# EAGLE design 2313 (EAGLE 7.5.0)
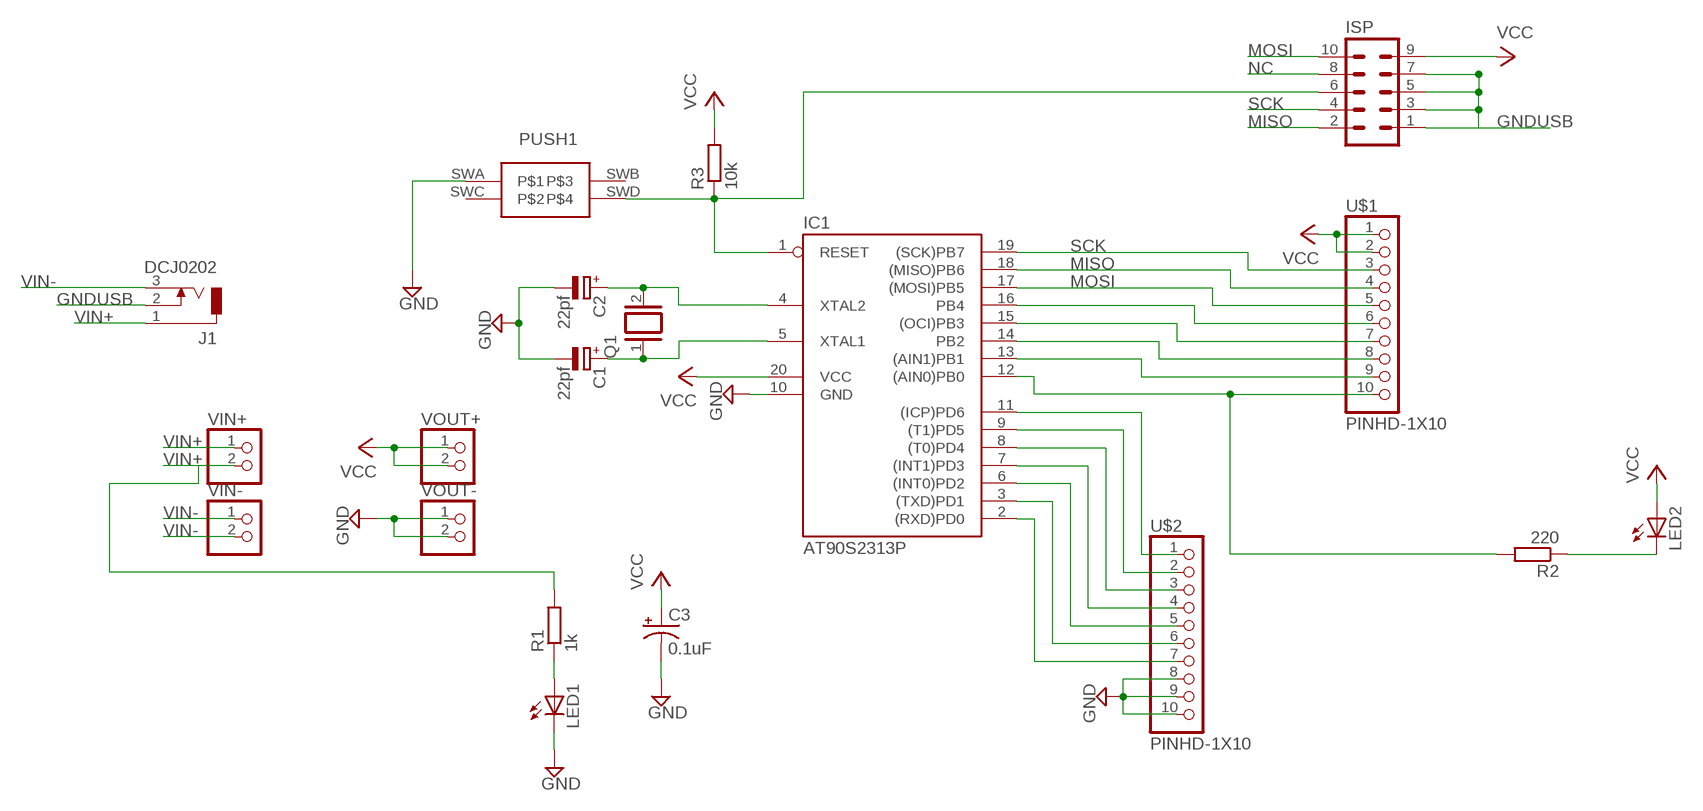
[diagram p0: schematic, sheet 1]

## Parts
C1  22pf  CPOL-EUE1.8-4  [E1,8-4]
C2  22pf  CPOL-EUE1.8-4  [E1,8-4]
C3  0.1uF  CPOL-USE1.8-4  [E1,8-4]
IC1  AT90S2313P  [DIL20]
ISP  MA05-2  [MA05-2]
J1  DCJ0202  [DCJ0202]
LED1  LED3MM  [LED3MM]
LED2  LED3MM  [LED3MM]
PUSH1  PUSH_BUTTON  [PUSH_BUTTON]
Q1  XTAL  [Q]
R1  1k  R-EU_0204/7  [0204/7]
R2  220  R-EU_0204/7  [0204/7]
R3  10k  R-EU_0204/7  [0204/7]
U$1  PINHD-1X10  [1X10-BIG]
U$2  PINHD-1X10  [1X10-BIG]
VIN+  PINHD-1X2  [1X02]
VIN-  PINHD-1X2  [1X02]
VOUT+  PINHD-1X2  [1X02]
VOUT-  PINHD-1X2  [1X02]

## Nets
GND: C1.- C2.- C3.- IC1.10(GND) LED1.K(C) PUSH1.SWA U$2.8 U$2.9 U$2.10 VOUT-.1 VOUT-.2
GNDUSB: ISP.1 ISP.3 ISP.5 ISP.7 J1.2
MISO: IC1.18((MISO)PB6) ISP.2 U$1.4
MOSI: IC1.17((MOSI)PB5) ISP.10 U$1.5
N$1: C1.+ IC1.5(XTAL1) Q1.1
N$2: C2.+ IC1.4(XTAL2) Q1.2
N$3: IC1.1(RESET) ISP.6 PUSH1.SWD R3.1
N$4: IC1.11((ICP)PD6) U$2.1
N$5: IC1.13((AIN1)PB1) U$1.9
N$6: IC1.14(PB2) U$1.8
N$7: IC1.15((OCI)PB3) U$1.7
N$8: IC1.16(PB4) U$1.6
N$9: IC1.12((AIN0)PB0) R2.2 U$1.10
N$10: IC1.9((T1)PD5) U$2.2
N$11: IC1.8((T0)PD4) U$2.3
N$12: IC1.7((INT1)PD3) U$2.4
N$13: IC1.6((INT0)PD2) U$2.5
N$14: IC1.3((TXD)PD1) U$2.6
N$15: IC1.2((RXD)PD0) U$2.7
N$16: LED1.A R1.1
N$17: LED2.K(C) R2.1
NC: ISP.8
SCK: IC1.19((SCK)PB7) ISP.4 U$1.3
VCC: C3.+ IC1.20(VCC) ISP.9 LED2.A R3.2 U$1.1 U$1.2 VOUT+.1 VOUT+.2
VIN+: J1.1 R1.2 VIN+.1 VIN+.2
VIN-: J1.3 VIN-.1 VIN-.2
Unconnected: PUSH1.SWB PUSH1.SWC

## Library data of the parts
C1 C2 = resistor:CPOL-EU: POLARIZED CAPACITOR, European symbol
C3 = adafruit:CPOL-US: POLARIZED CAPACITOR, American symbol
IC1 = atmel:AT90S2313: MICROCONTROLLER 2 Kbytes FLASH 128 bytes SRAM 128 bytes EEPROM UART; OC_FARNELL: unknown; OC_NEWARK: unknown
ISP = con-lstb:MA05-2: PIN HEADER; OC_FARNELL: unknown; OC_NEWARK: unknown
J1 = con-jack:DCJ0202: DC POWER JACK Source: DCJ0202.pdf; OC_FARNELL: unknown; OC_NEWARK: unknown
LED1 LED2 = adafruit:LED: LED OSRAM: - CHIPLED LG R971, LG N971, LY N971, LG Q971, LY Q971, LO R971, LY R971 LH N974, LH R974 LS Q976, LO Q976, LY Q976 LO Q996 - Hyper CHIPLED LW Q18S LB Q993, LB Q99A, LB R99A - SideLED LS A670, LO A670, LY A670, LG A670, LP A670 LB A673, LV A673, LT A673, LW A673 LH A674 LY A675 LS A676, LA A676, LO A676, LY A676, LW A676 LS A679, LY A679, LG A679 - Hyper Micro SIDELED® LS Y876, LA Y876, LO Y876, LY Y876 LT Y87S - SmartLED LW L88C, LW L88S LB L89C, LB L89S, LG L890 LS L89K, LO L89K, LY L89K LS L896, LA L896, LO L896, LY L896 - TOPLED LS T670, LO T670, LY T670, LG T670, LP T670 LSG T670, LSP T670, LSY T670, LOP T670, LYG T670 LG T671, LOG T671, LSG T671 LB T673, LV T673, LT T673, LW T673 LH T674 LS T676, LA T676, LO T676, LY T676, LB T676, LH T676, LSB T676, LW T676 LB T67C, LV T67C, LT T67C, LS T67K, LO T67K, LY T67K, LW E67C LS E67B, LA E67B, LO E67B, LY E67B, LB E67C, LV E67C, LT E67C LW T67C LS T679, LY T679, LG T679 LS T770, LO T770, LY T770, LG T770, LP T770 LB T773, LV T773, LT T773, LW T773 LH T774 LS E675, LA E675, LY E675, LS T675 LS T776, LA T776, LO T776, LY T776, LB T776 LHGB T686 LT T68C, LB T68C - Hyper Mini TOPLED® LB M676 - Mini TOPLED Santana® LG M470 LS M47K, LO M47K, LY M47K Source: http://www.osram.convergy.de/
PUSH1 = Evhyn:PUSH_BUTTON
Q1 = special:XTAL: CRYSTAL
R1-R3 = rcl:R-EU_: RESISTOR, European symbol
U$1 U$2 = adafruit:PINHD-1X10: Pin header 1x10 0.1" spacing With round pins
VIN+ VIN- VOUT+ VOUT- = pinhead:PINHD-1X2: PIN HEADER

## Board
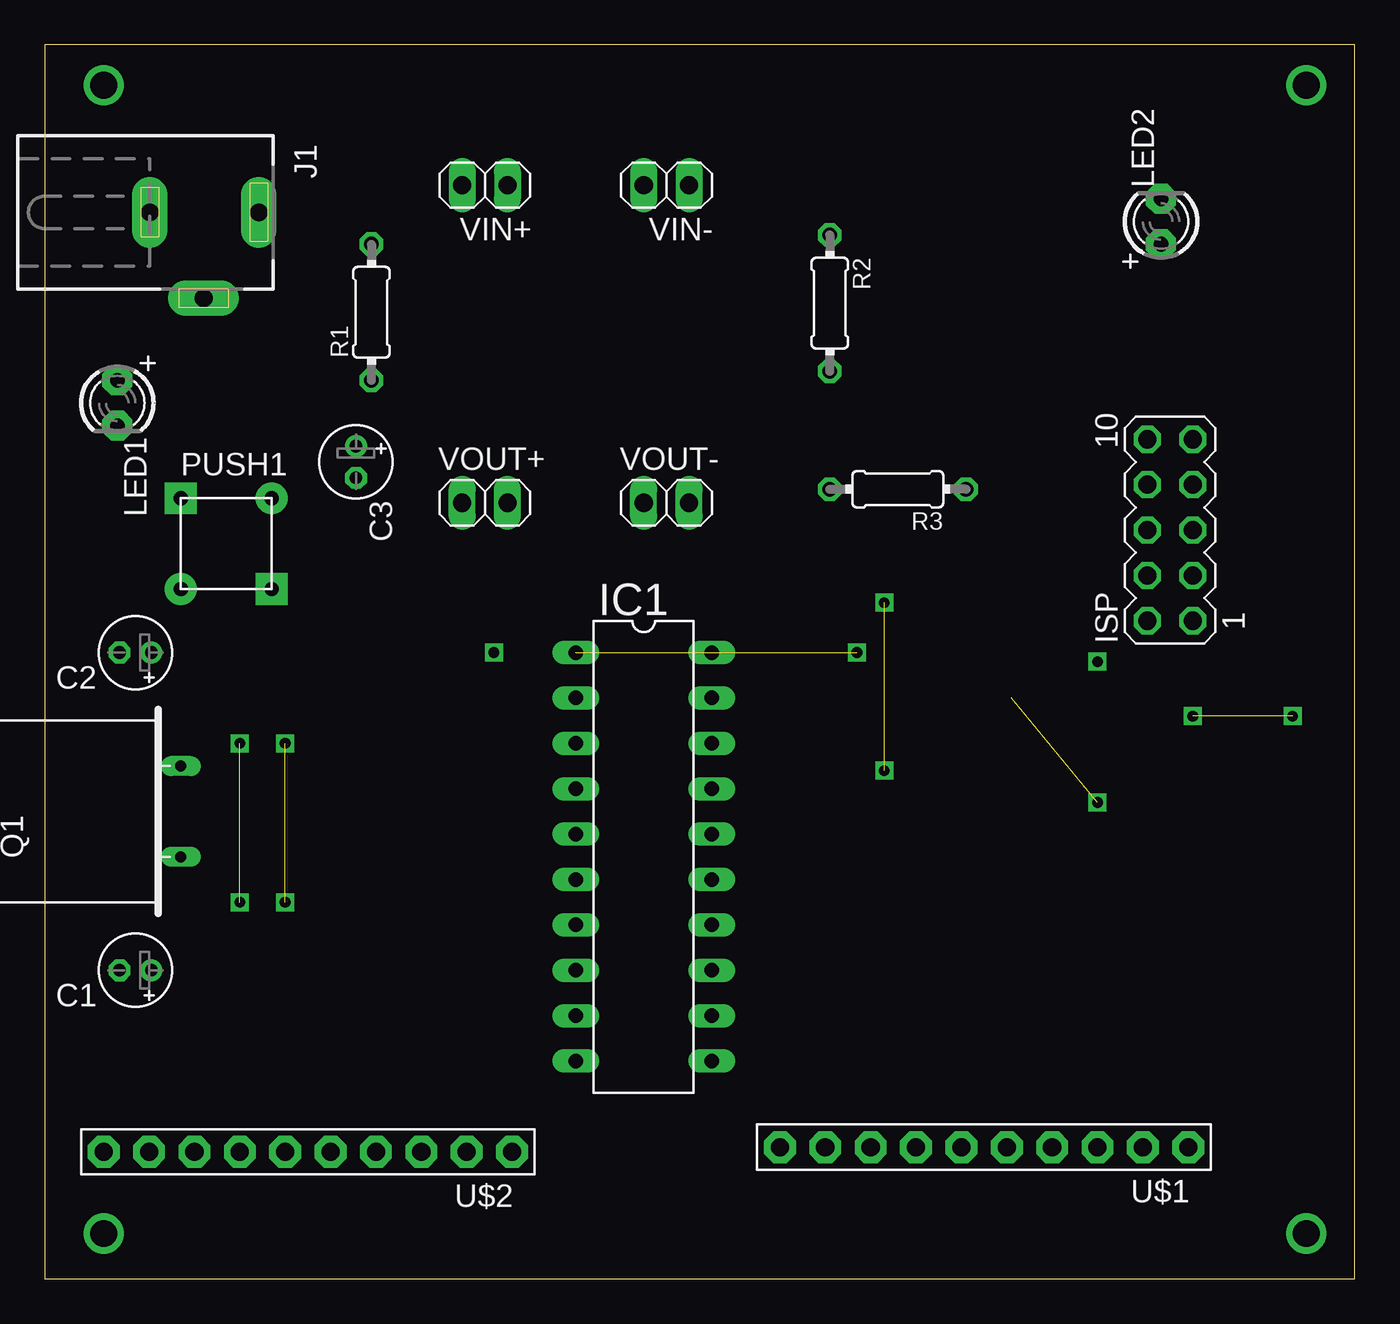
[diagram p1: board, top side]
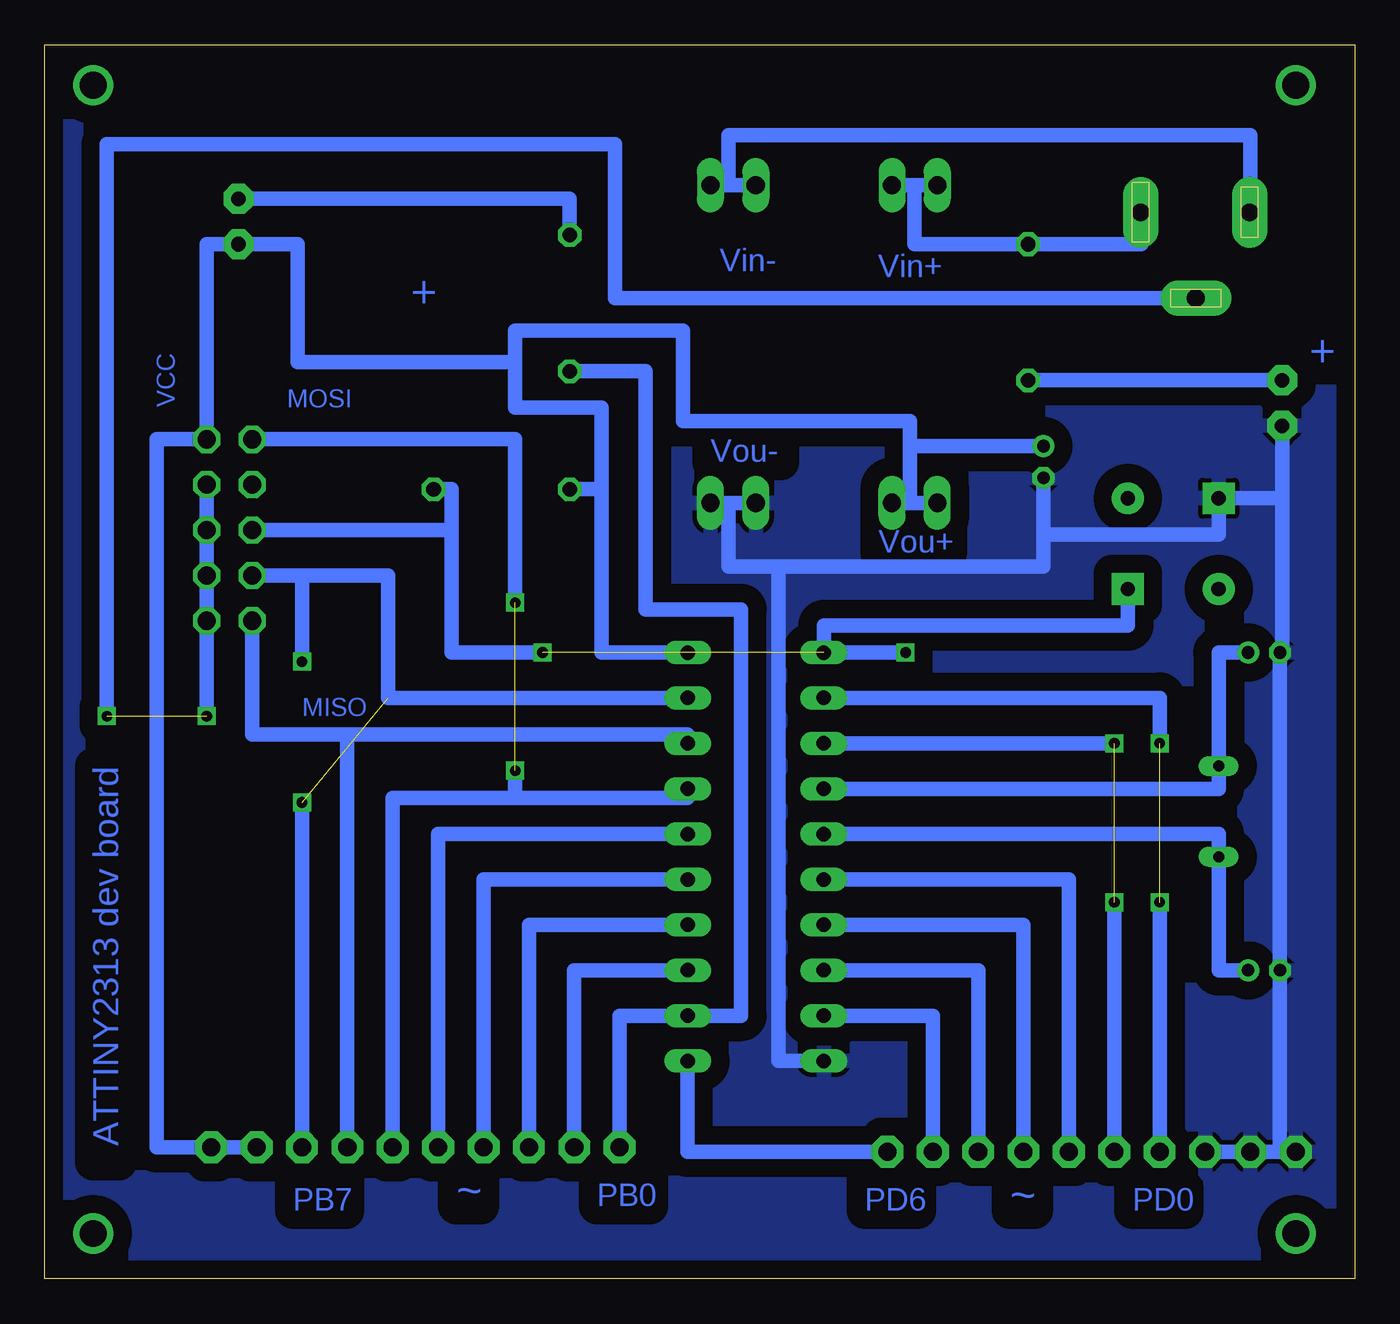
[diagram p2: board, bottom side, seen from below]

Size 73.33 x 69.08 mm. Coordinates in mm from the lower left corner, seen from the top.
Outline: 0,0 73.33,0 73.33,69.08 0,69.08 0,0
Copper layers (1*16): Top 0.035mm / dielectric 1.5mm / Bottom 0.035mm
Design rules "default *": minimum track width 24mil, minimum drill 24mil, track to track 40mil, track to pad 40mil, pad to pad 40mil, via to via 40mil, smd to smd 8mil, copper to edge 40mil, drill to drill 8mil, minimum pad ring 10mil, minimum via ring 8mil, stop-mask expansion 4mil, vias tented up to drill 0mil, thermal gap 10mil

### Footprints (pad centres in the part's own frame; a part is rotated, then mirrored left to right if it is on the bottom)
E1,8-4 = drill 0.711 pad 1.168: + -0.889,0 | drill 0.711 pad 1.168 octagon: - 0.889,0
DIL20 = drill 0.813 long: 1 -11.43,-3.81; 2 -8.89,-3.81; 3 -6.35,-3.81; 4 -3.81,-3.81; 5 -1.27,-3.81; 6 1.27,-3.81; 7 3.81,-3.81; 8 6.35,-3.81; 9 8.89,-3.81; 10 11.43,-3.81; 11 11.43,3.81; 12 8.89,3.81; 13 6.35,3.81; 14 3.81,3.81; 15 1.27,3.81; 16 -1.27,3.81; 17 -3.81,3.81; 18 -6.35,3.81; 19 -8.89,3.81; 20 -11.43,3.81
MA05-2 = drill 1.016 octagon: 1 -5.08,-1.27; 2 -5.08,1.27; 3 -2.54,-1.27; 4 -2.54,1.27; 5 0,-1.27; 6 0,1.27; 7 2.54,-1.27; 8 2.54,1.27; 9 5.08,-1.27; 10 5.08,1.27
DCJ0202 = drill 1 pad 2 long: 1 0,3.1; 2 4.8,0; 3 0,-3
LED3MM = drill 0.813 pad 1.676 octagon: A -1.27,0; K 1.27,0
PUSH_BUTTON = drill 0.8 pad 1.778 square: SWA 0,0; SWD 5.08,-5.08 | drill 0.8 pad 1.778: SWB 5.08,0; SWC 0,-5.08
Q = drill 0.61 long: 1 -2.54,-7.62; 2 2.54,-7.62
0204/7 = drill 0.813 octagon: 1 -3.81,0; 2 3.81,0
1X10-BIG = drill 1.016 pad 1.778 octagon: 1 -11.43,0; 2 -8.89,0; 3 -6.35,0; 4 -3.81,0; 5 -1.27,0; 6 1.27,0; 7 3.81,0; 8 6.35,0; 9 8.89,0; 10 11.43,0
1X02 = drill 1.016 long: 1 -1.27,0; 2 1.27,0

### Placement (x,y rotation side)
C1  5.08,17.27 180 top
C2  5.08,35.05 180 top
C3  17.42,45.72 270 top
IC1  33.53,23.62 270 top
ISP  62.99,41.91 90 top
J1  8.89,59.69 270 top
LED1  4.06,49.02 270 top
LED2  62.48,59.18 90 top
PUSH1  7.62,43.69 0 top
Q1  0,26.16 90 top
R1  18.29,54.1 90 top
R2  43.94,54.61 270 top
R3  47.75,44.2 180 top
U$1  52.58,7.37 180 top
U$2  14.73,7.11 180 top
VIN+  24.64,61.21 180 top
VIN-  34.8,61.21 180 top
VOUT+  24.64,43.43 0 top
VOUT-  34.8,43.43 0 top

### Tracks (layer width: path | path; a pad name or v marks a point on that pad's centre or on a via)
GND
  Bottom 0.813: VOUT-.1 35.05,43.43 | 35.05,43.43 VOUT-.2 | 32.26,39.88 35.05,39.88 35.05,43.43 | IC1.10 32.26,12.19 32.26,39.88 | 32.26,39.88 17.42,39.88 17.42,41.66 | 17.42,41.66 C3.- | U$2.8 U$2.9 4.19,7.11 | U$2.10 4.19,7.11 | 4.19,7.11 C1.- C2.- 4.06,35.05 4.06,43.69 | 4.06,43.69 LED1.K | 4.06,43.69 PUSH1.SWA 7.62,41.66 17.42,41.66
  pour Bottom: -0.51,69.34 -0.51,-0.51 73.15,-0.51 73.15,69.34
GNDUSB  (via drill 0.6)  (1 unrouted)
  Bottom 0.813: ISP.7 ISP.5 ISP.3 ISP.1 64.26,31.5 | v69.85,31.5 69.85,63.5 41.4,63.5 41.4,54.89 J1.2
MISO
  Bottom 0.813: ISP.2 61.72,30.48 56.39,30.48 | U$1.4 56.39,30.48 | IC1.18 37.34,30.48 56.39,30.48
MOSI  (via drill 0.6)  (1 unrouted)
  Bottom 0.813: ISP.10 46.99,46.99 v46.99,37.85 | IC1.17 37.34,26.92 46.99,26.92 | U$1.5 53.85,26.92 46.99,26.92 | 46.99,26.92 v46.99,28.45
N$1
  Bottom 0.813: IC1.5 7.62,24.89 Q1.1 7.62,17.27 C1.+
N$2
  Bottom 0.813: IC1.4 7.62,27.43 Q1.2 7.62,35.05 C2.+
N$3  (via drill 0.6)  (1 unrouted)
  Bottom 0.813: 50.55,41.91 50.55,35.05 v45.47,35.05 | ISP.6 50.55,41.91 | R3.1 50.55,44.2 50.55,41.91 | PUSH1.SWD 12.7,36.58 29.72,36.58 IC1.1 25.4,35.05
N$4
  Bottom 0.813: U$2.1 37.34,7.11 IC1.11
N$5
  Bottom 0.813: U$1.9 43.69,17.27 IC1.13
N$6
  Bottom 0.813: U$1.8 46.23,19.81 IC1.14
N$7
  Bottom 0.813: U$1.7 48.77,22.35 IC1.15
N$8
  Bottom 0.813: U$1.6 51.31,24.89 IC1.16
N$9
  Bottom 0.813: R2.2 39.69,50.8 39.69,37.46 34.35,37.46 34.35,14.73 IC1.12 41.15,14.73 U$1.10
N$10
  Bottom 0.813: U$2.2 23.62,14.73 IC1.9
N$11
  Bottom 0.813: U$2.3 21.08,17.27 IC1.8
N$12
  Bottom 0.813: U$2.4 18.54,19.81 IC1.7
N$13
  Bottom 0.813: IC1.6 16,22.35 U$2.5
N$14  (via drill 0.6)  (1 unrouted)
  Bottom 0.813: U$2.6 v13.46,21.08 | IC1.3 v13.46,29.97
N$15  (via drill 0.6)  (1 unrouted)
  Bottom 0.813: IC1.2 10.92,32.51 v10.92,29.97 | U$2.7 v10.92,21.08
N$16
  Bottom 0.813: LED1.A R1.1
N$17
  Bottom 0.813: R2.1 43.94,60.45 LED2.K
N$20  (via drill 1.5 pad 0.81)
  other vias: 3.3,66.8
N$21  (via drill 1.5 pad 0.81)
  other vias: 70.61,66.8
N$22  (via drill 1.5 pad 0.81)
  other vias: 3.3,2.54
N$23  (via drill 1.5 pad 0.81)
  other vias: 70.61,2.54
N$30  (via drill 0.6)
  other vias: 64.26,31.5
N$32  (via drill 0.6)
  other vias: 25.15,35.05
SCK  (via drill 0.6)  (1 unrouted)
  Bottom 0.813: U$1.3 v58.93,26.67 | IC1.19 54.1,32.51 54.1,39.37 58.93,39.37 | 58.93,39.37 ISP.4 | 58.93,39.37 v58.93,34.54
VCC
  Bottom 0.813: VOUT+.1 24.89,43.43 | 24.89,43.43 VOUT+.2 | IC1.20 42.16,35.05 42.16,44.2 | 42.16,44.2 42.16,48.77 46.99,48.77 46.99,51.31 | 46.99,51.31 46.99,53.09 37.59,53.09 37.59,48.01 24.89,48.01 24.89,46.61 | 46.99,51.31 59.18,51.31 59.18,57.91 LED2.A 64.26,57.91 ISP.9 67.06,46.99 67.06,7.37 U$1.2 U$1.1 | R3.2 42.16,44.2 | C3.+ 24.89,46.61 | 24.89,46.61 24.89,43.43
VIN+
  Bottom 0.813: VIN+.2 24.64,61.21 | 24.64,61.21 VIN+.1 | J1.1 11.94,60.2 11.94,57.91 R1.2 24.64,57.91 24.64,61.21
VIN-
  Bottom 0.813: J1.3 5.84,60.2 5.84,64.01 35.05,64.01 35.05,61.21 | VIN-.2 35.05,61.21 | 35.05,61.21 VIN-.1

### Text on the board
Bottom: Vin+ | Vin- | + | VCC | + | MOSI | Vou- | Vou+ | MISO | ATTINY2313 dev board | PD0 | ~ | PD6 | PB0 | ~ | PB7